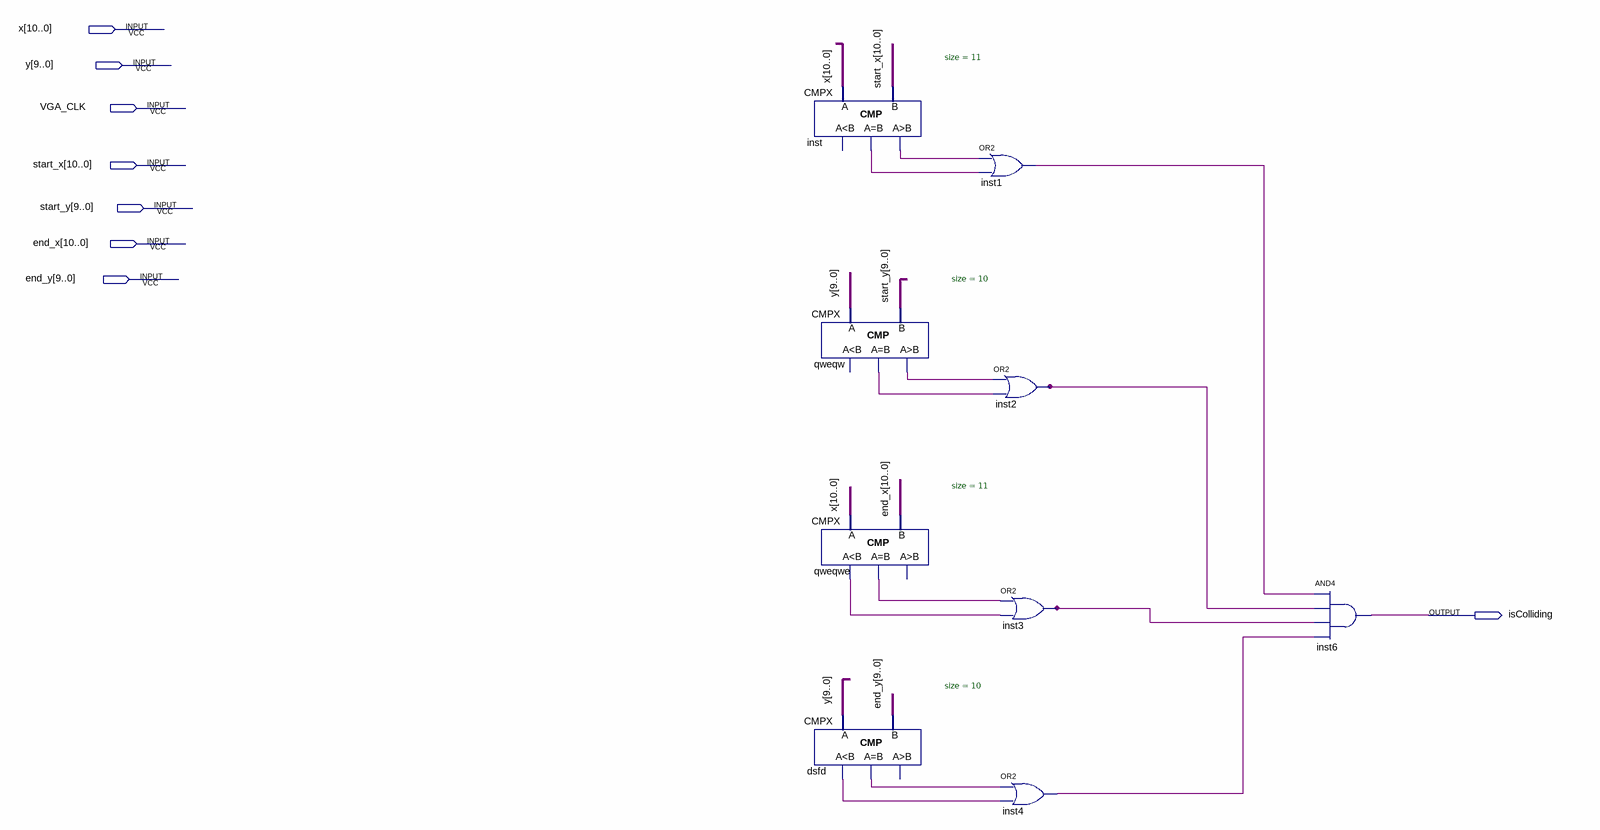
[diagram p0: schematic sheet]
// Quartus schematic object.bdf as structural Verilog: 9 symbols, 8 pins
module object (
  input  [10:0] x,
  input  [9:0] y,
  input  VGA_CLK,
  input  [10:0] start_x,
  input  [9:0] start_y,
  input  [10:0] end_x,
  input  [9:0] end_y,
  output isColliding
);

  wire dsfd_eq, dsfd_ls, inst1_out, inst2_out, inst3_out, inst4_out, inst_eq, inst_gr, qweqw_eq, qweqw_gr,
       qweqwe_eq, qweqwe_ls;

  CMPX #(.size(11)) inst (.A(x), .B(start_x), .eq(inst_eq), .gr(inst_gr));  // open: ls
  CMPX #(.size(10)) qweqw (.A(y), .B(start_y), .eq(qweqw_eq), .gr(qweqw_gr));  // open: ls
  CMPX #(.size(11)) qweqwe (.A(x), .B(end_x), .ls(qweqwe_ls), .eq(qweqwe_eq));  // open: gr
  CMPX #(.size(10)) dsfd (.A(y), .B(end_y), .ls(dsfd_ls), .eq(dsfd_eq));  // open: gr
  or inst1 (inst1_out, inst_gr, inst_eq);
  or inst2 (inst2_out, qweqw_gr, qweqw_eq);
  or inst3 (inst3_out, qweqwe_eq, qweqwe_ls);
  or inst4 (inst4_out, dsfd_eq, dsfd_ls);
  and inst6 (isColliding, inst1_out, inst2_out, inst3_out, inst4_out);
endmodule
